# EAGLE design sensor suhu (EAGLE 9.5.2)
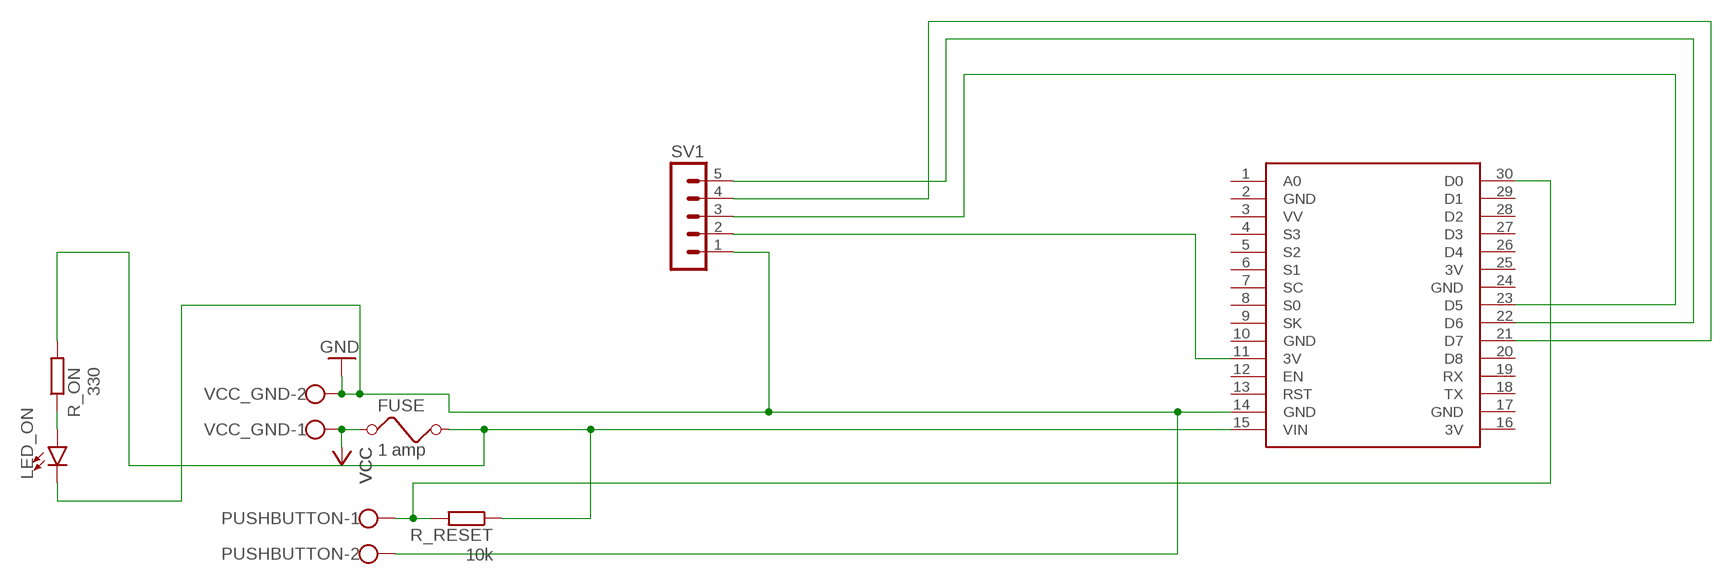
[diagram p0: schematic, sheet 1]

## Parts
FUSE  1 amp  FUSE  [FUSE]
LED_ON  LED5MM  [LED_5MM]
PUSHBUTTON  W237-102  [W237-102]
R_ON  330  R-EU_0207/10  [0207/10]
R_RESET  10k  R-EU_0207/10  [0207/10]
SV1  MA05-1  [MA05-1]
U$1  NODEMCU  [NODEMCU]
VCC_GND  W237-102  [W237-102]

## Nets
GND [gnd]: LED_ON.K(C) PUSHBUTTON.2 SV1.1 U$1.14(GND) VCC_GND.2
N$1: SV1.3 U$1.23(D5)
N$2: SV1.4 U$1.21(D7)
N$3: SV1.5 U$1.22(D6)
N$4 [vcc]: SV1.2 U$1.11(3V)
N$9: PUSHBUTTON.1 R_RESET.2 U$1.30(D0)
N$10: LED_ON.A R_ON.1
VCC [vcc]: FUSE.1 FUSE.2 R_ON.2 R_RESET.1 U$1.15(VIN) VCC_GND.1
Unconnected: U$1.1(A0) U$1.3(VV) U$1.4(S3) U$1.5(S2) U$1.6(S1) U$1.7(SC) U$1.8(S0) U$1.9(SK) U$1.12(EN) U$1.13(RST) U$1.18(TX) U$1.19(RX) U$1.20(D8) U$1.26(D4) U$1.27(D3) U$1.28(D2) U$1.29(D1)

## Power pins joined to a net without a drawn wire
3V: U$1.16(3V) U$1.25(3V)
GND: U$1.2(GND) U$1.10(GND) U$1.17(GND) U$1.24(GND)

## Library data of the parts
FUSE = special:FUSE: FUSE 5 x 20 mm
LED_ON = SparkFun-LED:LED: LED (Generic) Standard schematic elements and footprints for 5mm, 3mm, 1206, and 0603 sized LEDs. Generic LEDs with no color specified.
PUSHBUTTON VCC_GND = con-wago-500:W237-102: WAGO SCREW CLAMP; MPN: 237-102; OC_FARNELL: unknown; OC_NEWARK: 70K9898
R_ON R_RESET = rcl:R-EU_: RESISTOR, European symbol; SPICEPREFIX: R
SV1 = con-lstb:MA05-1: PIN HEADER; OC_FARNELL: unknown; OC_NEWARK: unknown
U$1 = nodemcu:NODEMCU

## Net classes
0 default: width 1.27 mm, clearance 0.762 mm
1 vcc: width 1.524 mm, clearance 0.762 mm to class 0
2 gnd: width 1.524 mm, clearance 0.762 mm to class 0

## Board
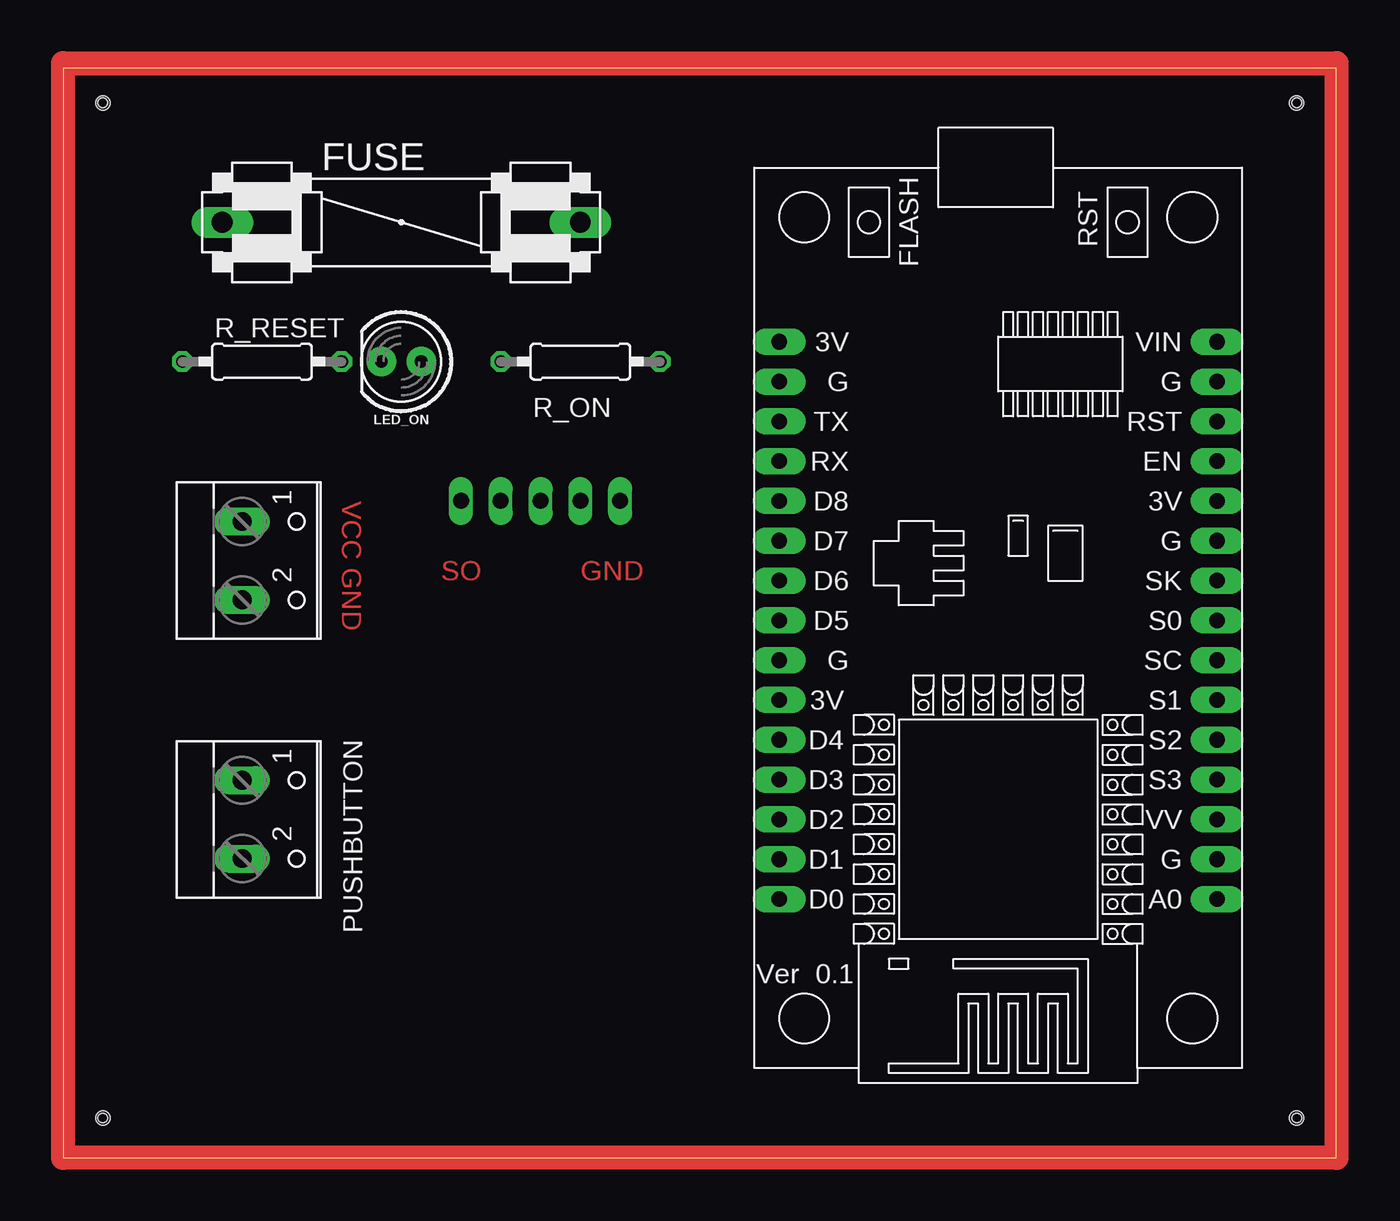
[diagram p1: board, top side]
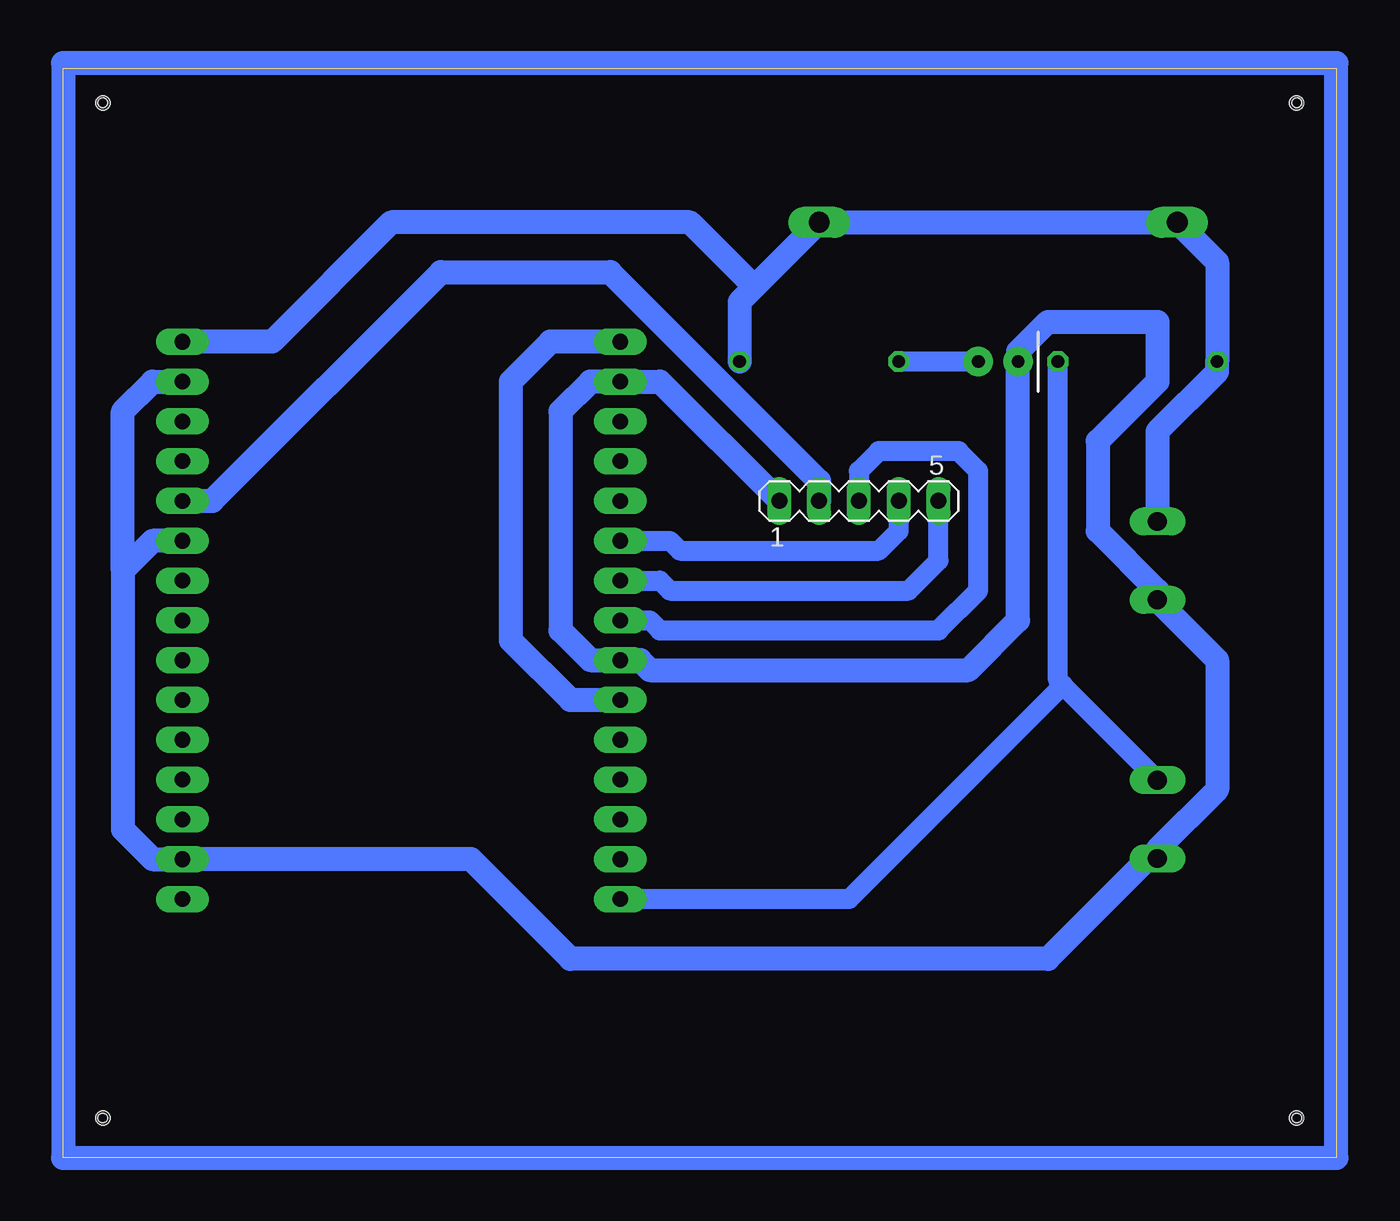
[diagram p2: board, bottom side, seen from below]

Size 81.26 x 69.52 mm. Coordinates in mm from the lower left corner, seen from the top.
Outline: 0,0 81.26,0 81.26,69.52 0,69.52 0,0
Copper layers (1*16): Top 0.035mm / dielectric 1.5mm / Bottom 0.035mm
Design rules "default": minimum track width 6mil, minimum drill 0.35mm, track to track 6mil, track to pad 6mil, pad to pad 6mil, via to via 6mil, smd to smd 6mil, copper to edge 40mil, drill to drill 6mil, minimum pad ring 10mil, minimum via ring 8mil, stop-mask expansion 4mil, vias tented up to drill 0mil, thermal gap 10mil
Holes 0.6 mm at 2.54,67.31 78.74,67.31 78.74,2.54 2.54,2.54
Holes 0.9 mm at 2.54,67.31 78.74,67.31 78.74,2.54 2.54,2.54 2.54,67.31 78.74,67.31 78.74,2.54 2.54,2.54

### Footprints (pad centres in the part's own frame; a part is rotated, then mirrored left to right if it is on the bottom)
FUSE = drill 1.321 long: 1 -11.43,0; 2 11.43,0
LED_5MM = drill 0.813 pad 1.88: A -1.27,0; K 1.27,0
W237-102 = drill 1.194 long: 1 -2.5,-1.27; 2 2.5,-1.27
0207/10 = drill 0.813 octagon: 1 -5.08,0; 2 5.08,0
MA05-1 = drill 1.016 long: 1 -5.08,0; 2 -2.54,0; 3 0,0; 4 2.54,0; 5 5.08,0
NODEMCU = drill 1 pad 1.676 long: 1 -13.97,17.78; 2 -13.97,15.24; 3 -13.97,12.7; 4 -13.97,10.16; 5 -13.97,7.62; 6 -13.97,5.08; 7 -13.97,2.54; 8 -13.97,0; 9 -13.97,-2.54; 10 -13.97,-5.08; 11 -13.97,-7.62; 12 -13.97,-10.16; 13 -13.97,-12.7; 14 -13.97,-15.24; 15 -13.97,-17.78; 16 13.97,-17.78; 17 13.97,-15.24; 18 13.97,-12.7; 19 13.97,-10.16; 20 13.97,-7.62; 21 13.97,-5.08; 22 13.97,-2.54; 23 13.97,0; 24 13.97,2.54; 25 13.97,5.08; 26 13.97,7.62; 27 13.97,10.16; 28 13.97,12.7; 29 13.97,15.24; 30 13.97,17.78

### Placement (x,y rotation side)
FUSE  21.59,59.69 0 top
LED_ON  21.59,50.8 180 top
PUSHBUTTON  12.7,21.59 270 top
R_ON  33.02,50.8 0 top
R_RESET  12.7,50.8 0 top
SV1  30.48,41.91 0 bottom
U$1  59.69,34.29 180 top
VCC_GND  12.7,38.1 270 top

### Tracks (layer width: path | path; a pad name or v marks a point on that pad's centre or on a via)
3V
  Bottom 1.524: U$1.25 48.9,29.21 52.7,33.02 52.7,49.53 50.17,52.07 U$1.16
GND
  Bottom 1.524: 77.47,37.47 77.47,20.96 75.57,19.05 U$1.2 55.25,19.05 48.9,12.7 18.42,12.7 12.07,19.05 PUSHBUTTON.2 11.43,19.68 7.62,23.5 7.62,31.75 11.43,35.56 VCC_GND.2 11.43,36.19 15.24,40 15.24,45.72 11.43,49.53 11.43,53.34 18.42,53.34 20.32,51.44 LED_ON.K 20.32,34.29 23.5,31.11 43.82,31.11 44.45,31.75 U$1.24 47.62,31.75 49.53,33.66 49.53,47.62 47.62,49.53 U$1.17 43.18,49.53 SV1.1 | 77.47,37.47 75.57,39.37 U$1.10 | U$1.14 75.57,49.53 77.47,47.62 77.47,37.47
N$1
  Bottom 1.27: SV1.3 30.48,43.81 29.21,45.08 24.13,45.08 22.86,43.81 22.86,36.19 25.4,33.66 43.18,33.66 43.82,34.29 U$1.23
N$2
  Bottom 1.27: SV1.4 27.94,40 29.21,38.73 41.91,38.73 42.55,39.37 U$1.21
N$3
  Bottom 1.27: SV1.5 25.4,38.1 27.31,36.19 42.55,36.19 43.18,36.83 U$1.22
N$4
  Bottom 1.524: SV1.2 33.02,43.18 46.36,56.52 57.15,56.52 71.76,41.91 U$1.11
N$5
  Bottom 1.524: 0,69.85 81.28,69.85 81.28,0 0,0 0,69.85
N$6
  Top 1.524: 0,69.85 81.28,69.85 81.28,0 0,0 0,69.85
N$9
  Bottom 1.27: R_RESET.2 17.78,30.48 17.46,30.16 | 17.46,30.16 11.43,24.13 PUSHBUTTON.1 | U$1.30 31.12,16.51 17.46,30.16
N$10
  Bottom 1.27: LED_ON.A R_ON.1
VCC
  Bottom 1.524: VCC_GND.1 11.43,46.35 7.62,50.16 R_RESET.1 7.62,57.15 FUSE.1 FUSE.2 37.15,55.56 | R_ON.2 38.1,54.61 37.15,55.56 | U$1.15 67.95,52.07 60.33,59.69 41.28,59.69 37.15,55.56

### Text on the board
Top: VCC GND | SO | GND